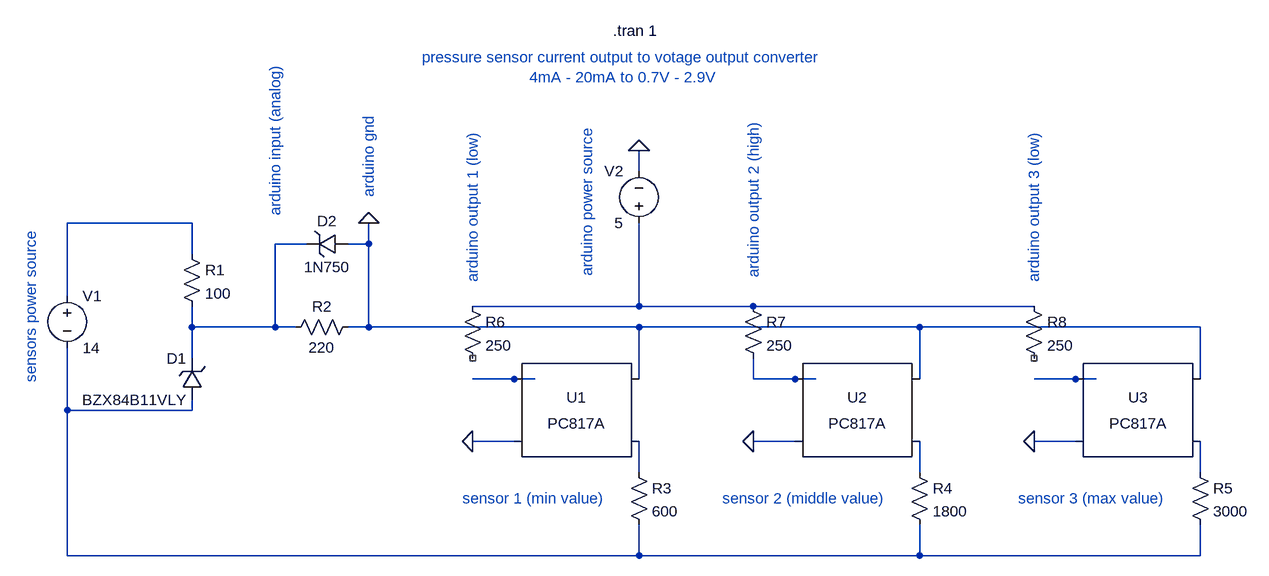
[diagram p0: schematic pressure_sensor_current_to_voltage_output.asc]
pressure_sensor_current_to_voltage_output.asc, the LTspice schematic file:
Version 4
SHEET 1 2112 680
WIRE 960 -80 960 -112
WIRE 272 0 80 0
WIRE 448 32 400 32
WIRE 544 32 544 0
WIRE 544 32 512 32
WIRE 272 48 272 0
WIRE 80 112 80 0
WIRE 960 128 960 0
WIRE 960 128 704 128
WIRE 1136 128 960 128
WIRE 1568 128 1136 128
WIRE 272 160 272 128
WIRE 400 160 400 32
WIRE 400 160 272 160
WIRE 432 160 400 160
WIRE 544 160 544 32
WIRE 544 160 512 160
WIRE 960 160 544 160
WIRE 1392 160 960 160
WIRE 1824 160 1392 160
WIRE 272 208 272 160
WIRE 768 240 704 240
WIRE 800 240 768 240
WIRE 960 240 960 160
WIRE 1136 240 1136 208
WIRE 1200 240 1136 240
WIRE 1232 240 1200 240
WIRE 1392 240 1392 160
WIRE 1632 240 1568 240
WIRE 1664 240 1632 240
WIRE 1824 240 1824 160
WIRE 80 288 80 192
WIRE 272 288 272 272
WIRE 272 288 80 288
WIRE 768 336 704 336
WIRE 1200 336 1136 336
WIRE 1632 336 1568 336
WIRE 960 384 960 336
WIRE 1392 384 1392 336
WIRE 1824 384 1824 336
WIRE 80 512 80 288
WIRE 960 512 960 464
WIRE 960 512 80 512
WIRE 1392 512 1392 464
WIRE 1392 512 960 512
WIRE 1824 512 1824 464
WIRE 1824 512 1392 512
FLAG 704 336 0
FLAG 1136 336 0
FLAG 1568 336 0
FLAG 960 -112 0
FLAG 544 0 0
SYMBOL voltage 80 96 R0
WINDOW 123 0 0 Left 0
WINDOW 39 0 0 Left 0
SYMATTR InstName V1
SYMATTR Value 14
SYMBOL res 256 32 R0
SYMATTR InstName R1
SYMATTR Value 100
SYMBOL zener 288 272 R180
WINDOW 0 24 64 Left 2
WINDOW 3 24 0 Left 2
SYMATTR InstName D1
SYMATTR Value BZX84B11VLY
SYMBOL res 528 144 R90
WINDOW 0 0 56 VBottom 2
WINDOW 3 32 56 VTop 2
SYMATTR InstName R2
SYMATTR Value 220
SYMBOL zener 512 16 R90
WINDOW 0 -4 32 VBottom 2
WINDOW 3 36 32 VTop 2
SYMATTR InstName D2
SYMATTR Value 1N750
SYMBOL Optos\\PC817A 864 288 R0
SYMATTR InstName U1
SYMBOL res 944 368 R0
SYMATTR InstName R3
SYMATTR Value 600
SYMBOL Optos\\PC817A 1296 288 R0
SYMATTR InstName U2
SYMBOL res 1376 368 R0
SYMATTR InstName R4
SYMATTR Value 1800
SYMBOL Optos\\PC817A 1728 288 R0
SYMATTR InstName U3
SYMBOL voltage 960 16 R180
WINDOW 0 24 96 Left 2
WINDOW 3 24 16 Left 2
WINDOW 123 0 0 Left 0
WINDOW 39 0 0 Left 0
SYMATTR InstName V2
SYMATTR Value 5
SYMBOL res 1808 368 R0
SYMATTR InstName R5
SYMATTR Value 3000
SYMBOL res 688 112 R0
SYMATTR InstName R6
SYMATTR Value 250
SYMBOL res 1120 112 R0
SYMATTR InstName R7
SYMATTR Value 250
SYMBOL res 1552 112 R0
SYMATTR InstName R8
SYMATTR Value 250
TEXT 920 -296 Left 2 !.tran 1
TEXT 936 -240 Center 2 ;pressure sensor current output to votage output converter\n4mA - 20mA to 0.7V - 2.9V
TEXT 24 8 VRight 2 ;sensors power source
TEXT 688 424 Left 2 ;sensor 1 (min value)
TEXT 1088 424 Left 2 ;sensor 2 (middle value)
TEXT 1544 424 Left 2 ;sensor 3 (max value)
TEXT 704 -144 VRight 2 ;arduino output 1 (low)
TEXT 1136 -160 VRight 2 ;arduino output 2 (high)
TEXT 1568 -144 VRight 2 ;arduino output 3 (low)
TEXT 880 -152 VRight 2 ;arduino power source
TEXT 400 -248 VRight 2 ;arduino input (analog)
TEXT 544 -168 VRight 2 ;arduino gnd

The netlist it stands for:
* pressure_sensor_current_to_voltage_output.asc
V1 N001 N007 14
R1 N001 N002 100
D1 N007 N002 BZX84B11VLY
R2 0 N002 220
D2 0 N002 1N750
XU1 N004 0 0 N008 PC817 Igain=1m
R3 N008 N007 600
XU2 N005 0 0 N009 PC817 Igain=1m
R4 N009 N007 1800
XU3 N006 0 0 N010 PC817 Igain=1m
V2 N003 0 5
R5 N010 N007 3000
R6 N003 NC_01 250
R7 N003 N005 250
R8 N003 NC_02 250
.model D D
.lib standard.dio
.tran 1
* pressure sensor current output to votage output converter
* 4mA - 20mA to 0.7V - 2.9V
* sensors power source
* sensor 1 (min value)
* sensor 2 (middle value)
* sensor 3 (max value)
* arduino output 1 (low)
* arduino output 2 (high)
* arduino output 3 (low)
* arduino power source
* arduino input (analog)
* arduino gnd
.lib PC817.sub
.backanno
.end